# Altium schematic sheet Top.SchDoc: Top
size A4; Date: Not used; ApprovedBy: Not used; CheckedBy: Not used; Author: Not used; CompanyName: STMicroelectronics; DrawnBy: Not used; Engineer: Not used; Organization: Not used; Address1: Not used; Address2: Not used; Address3: Not used; Address4: Not used; DocumentNumber: 2; Revision: Not used; SheetNumber: 2; SheetTotal: 9; CurrentTime: Not used; CurrentDate: Not used; Time: Not used; DocumentFullPathAndName: Not used; DocumentName: Not used; ModifiedDate: Not used; ImagePath: Not used; ProjectName: Not used; Application_BuildNumber: Not used
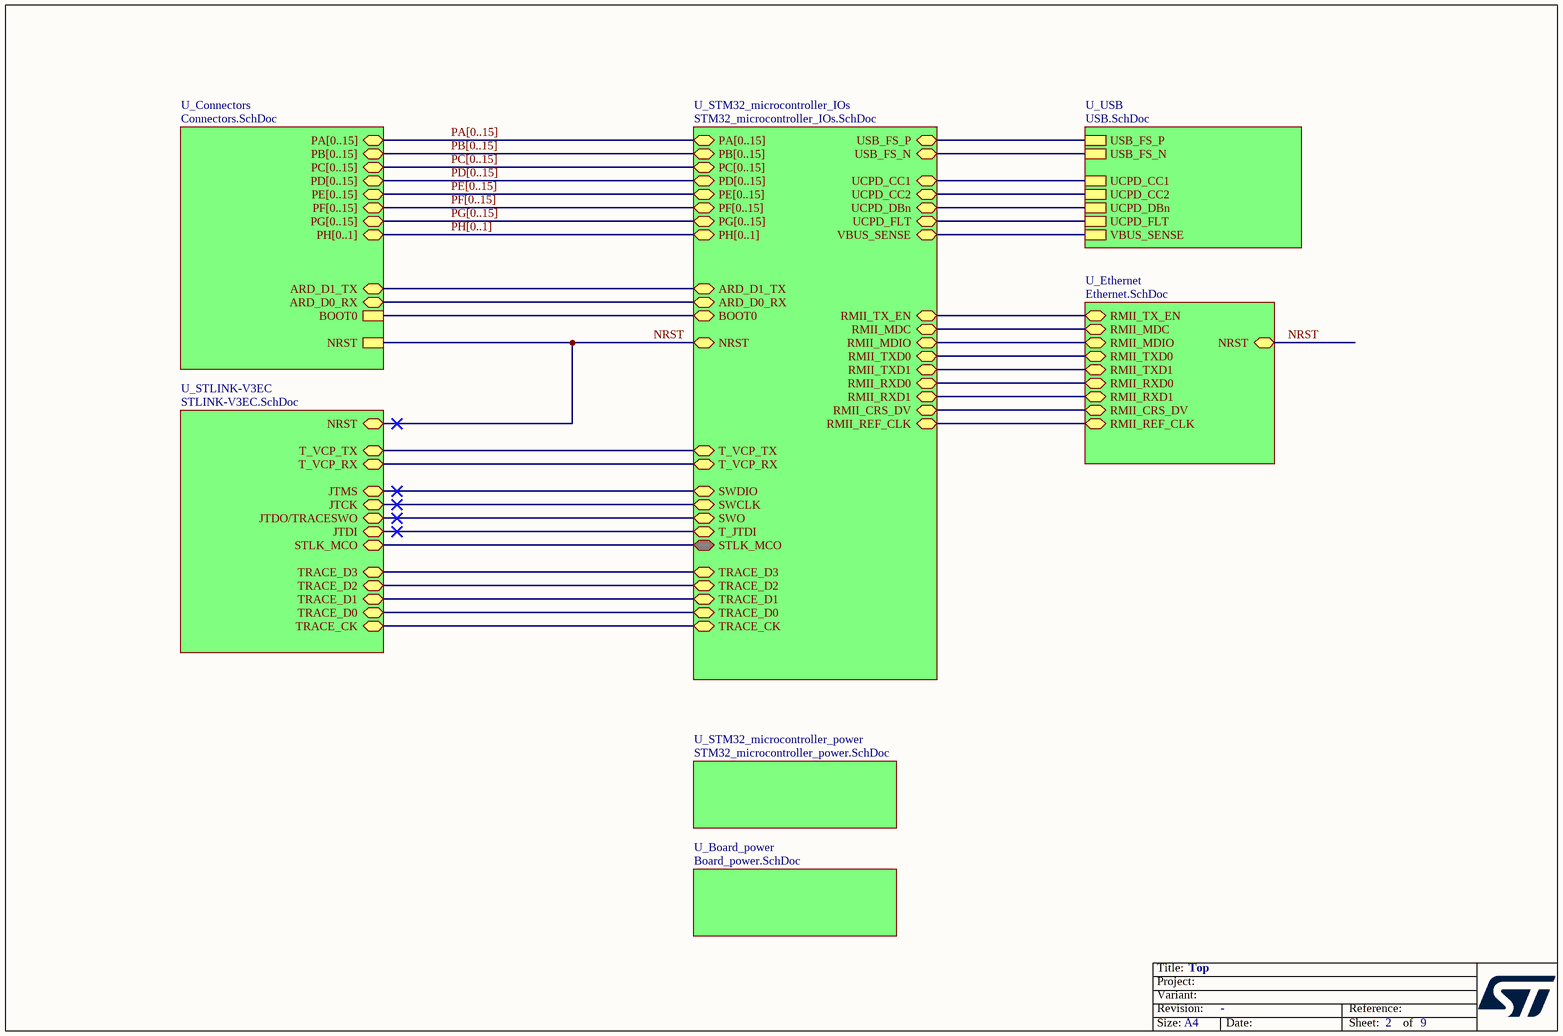
[diagram p0: Top.SchDoc]

## Sub-sheets
U_Board_power = Board_power.SchDoc: no entries
U_Connectors = Connectors.SchDoc: PA[0..15] (bidir), PB[0..15] (bidir), PC[0..15] (bidir), PD[0..15] (bidir), PE[0..15] (bidir), PH[0..1] (bidir), ARD_D1_TX (bidir), ARD_D0_RX (bidir), NRST, BOOT0, PF[0..15] (bidir), PG[0..15] (bidir)
U_Ethernet = Ethernet.SchDoc: RMII_CRS_DV (bidir), RMII_REF_CLK (bidir), RMII_TXD0 (bidir), RMII_RXD0 (bidir), RMII_TX_EN (bidir), NRST (bidir), RMII_RXD1 (bidir), RMII_MDC (bidir), RMII_TXD1 (bidir), RMII_MDIO (bidir)
U_STLINK-V3EC = STLINK-V3EC.SchDoc: STLK_MCO (bidir), NRST (bidir), JTCK (bidir), JTMS (bidir), JTDI (bidir), T_VCP_TX (bidir), T_VCP_RX (bidir), JTDO/TRACESWO (bidir), TRACE_CK (bidir), TRACE_D0 (bidir), TRACE_D1 (bidir), TRACE_D2 (bidir), TRACE_D3 (bidir)
U_STM32_microcontroller_IOs = STM32_microcontroller_IOs.SchDoc: NRST (bidir), PA[0..15] (bidir), PB[0..15] (bidir), PC[0..15] (bidir), PD[0..15] (bidir), PE[0..15] (bidir), PG[0..15] (bidir), PH[0..1] (bidir), SWCLK (bidir), BOOT0 (bidir), STLK_MCO (bidir), USB_FS_N (bidir), USB_FS_P (bidir), RMII_RXD0 (bidir), RMII_REF_CLK (bidir), RMII_CRS_DV (bidir), RMII_MDC (bidir), RMII_MDIO (bidir), RMII_RXD1 (bidir), RMII_TXD1 (bidir), RMII_TXD0 (bidir), RMII_TX_EN (bidir), SWDIO (bidir), SWO (bidir), PF[0..15] (bidir), T_VCP_RX (bidir), T_VCP_TX (bidir), ARD_D0_RX (bidir), ARD_D1_TX (bidir), T_JTDI (bidir), UCPD_CC1 (bidir), UCPD_CC2 (bidir), UCPD_DBn (bidir), UCPD_FLT (bidir), VBUS_SENSE (bidir), TRACE_CK (bidir), TRACE_D0 (bidir), TRACE_D1 (bidir), TRACE_D2 (bidir), TRACE_D3 (bidir)
U_STM32_microcontroller_power = STM32_microcontroller_power.SchDoc: no entries
U_USB = USB.SchDoc: USB_FS_N, USB_FS_P, UCPD_CC2, UCPD_FLT, UCPD_DBn, UCPD_CC1, VBUS_SENSE

## Nets
NRST: sheet U_Connectors/NRST, sheet U_Ethernet/NRST, sheet U_STM32_microcontroller_IOs/NRST, sheet U_STLINK-V3EC/NRST
(unnamed): sheet U_Connectors/ARD_D1_TX, sheet U_STM32_microcontroller_IOs/ARD_D1_TX
(unnamed): sheet U_Connectors/ARD_D0_RX, sheet U_STM32_microcontroller_IOs/ARD_D0_RX
(unnamed): sheet U_Connectors/BOOT0, sheet U_STM32_microcontroller_IOs/BOOT0
(unnamed): sheet U_USB/USB_FS_N, sheet U_STM32_microcontroller_IOs/USB_FS_N
(unnamed): sheet U_USB/USB_FS_P, sheet U_STM32_microcontroller_IOs/USB_FS_P
(unnamed): sheet U_USB/UCPD_CC2, sheet U_STM32_microcontroller_IOs/UCPD_CC2
(unnamed): sheet U_USB/UCPD_FLT, sheet U_STM32_microcontroller_IOs/UCPD_FLT
(unnamed): sheet U_USB/UCPD_DBn, sheet U_STM32_microcontroller_IOs/UCPD_DBn
(unnamed): sheet U_USB/UCPD_CC1, sheet U_STM32_microcontroller_IOs/UCPD_CC1
(unnamed): sheet U_USB/VBUS_SENSE, sheet U_STM32_microcontroller_IOs/VBUS_SENSE
(unnamed): sheet U_Ethernet/RMII_CRS_DV, sheet U_STM32_microcontroller_IOs/RMII_CRS_DV
(unnamed): sheet U_Ethernet/RMII_REF_CLK, sheet U_STM32_microcontroller_IOs/RMII_REF_CLK
(unnamed): sheet U_Ethernet/RMII_TXD0, sheet U_STM32_microcontroller_IOs/RMII_TXD0
(unnamed): sheet U_Ethernet/RMII_RXD0, sheet U_STM32_microcontroller_IOs/RMII_RXD0
(unnamed): sheet U_Ethernet/RMII_TX_EN, sheet U_STM32_microcontroller_IOs/RMII_TX_EN
(unnamed): sheet U_Ethernet/RMII_RXD1, sheet U_STM32_microcontroller_IOs/RMII_RXD1
(unnamed): sheet U_Ethernet/RMII_MDC, sheet U_STM32_microcontroller_IOs/RMII_MDC
(unnamed): sheet U_Ethernet/RMII_TXD1, sheet U_STM32_microcontroller_IOs/RMII_TXD1
(unnamed): sheet U_Ethernet/RMII_MDIO, sheet U_STM32_microcontroller_IOs/RMII_MDIO
(unnamed): sheet U_STM32_microcontroller_IOs/SWCLK, sheet U_STLINK-V3EC/JTCK
(unnamed): sheet U_STM32_microcontroller_IOs/STLK_MCO, sheet U_STLINK-V3EC/STLK_MCO
(unnamed): sheet U_STM32_microcontroller_IOs/SWDIO, sheet U_STLINK-V3EC/JTMS
(unnamed): sheet U_STM32_microcontroller_IOs/SWO, sheet U_STLINK-V3EC/JTDO/TRACESWO
(unnamed): sheet U_STM32_microcontroller_IOs/T_VCP_RX, sheet U_STLINK-V3EC/T_VCP_RX
(unnamed): sheet U_STM32_microcontroller_IOs/T_VCP_TX, sheet U_STLINK-V3EC/T_VCP_TX
(unnamed): sheet U_STM32_microcontroller_IOs/T_JTDI, sheet U_STLINK-V3EC/JTDI
(unnamed): sheet U_STM32_microcontroller_IOs/TRACE_CK, sheet U_STLINK-V3EC/TRACE_CK
(unnamed): sheet U_STM32_microcontroller_IOs/TRACE_D0, sheet U_STLINK-V3EC/TRACE_D0
(unnamed): sheet U_STM32_microcontroller_IOs/TRACE_D1, sheet U_STLINK-V3EC/TRACE_D1
(unnamed): sheet U_STM32_microcontroller_IOs/TRACE_D2, sheet U_STLINK-V3EC/TRACE_D2
(unnamed): sheet U_STM32_microcontroller_IOs/TRACE_D3, sheet U_STLINK-V3EC/TRACE_D3

## Buses and harness runs
bus PA[0..15] = sheet U_Connectors/PA[0..15] = sheet U_STM32_microcontroller_IOs/PA[0..15]
bus PB[0..15] = sheet U_Connectors/PB[0..15] = sheet U_STM32_microcontroller_IOs/PB[0..15]
bus PC[0..15] = sheet U_Connectors/PC[0..15] = sheet U_STM32_microcontroller_IOs/PC[0..15]
bus PD[0..15] = sheet U_Connectors/PD[0..15] = sheet U_STM32_microcontroller_IOs/PD[0..15]
bus PE[0..15] = sheet U_Connectors/PE[0..15] = sheet U_STM32_microcontroller_IOs/PE[0..15]
bus PF[0..15] = sheet U_Connectors/PF[0..15] = sheet U_STM32_microcontroller_IOs/PF[0..15]
bus PG[0..15] = sheet U_Connectors/PG[0..15] = sheet U_STM32_microcontroller_IOs/PG[0..15]
bus PH[0..1] = sheet U_Connectors/PH[0..1] = sheet U_STM32_microcontroller_IOs/PH[0..1]

## Notes on the sheet
- Title:
- Project:
- Size:
- Revision:
- Variant:
- A4
- -
- Date:
- Reference:
- Sheet:
- of